# Altium schematic sheet haptic_ring_prototype.SchDoc
size A4
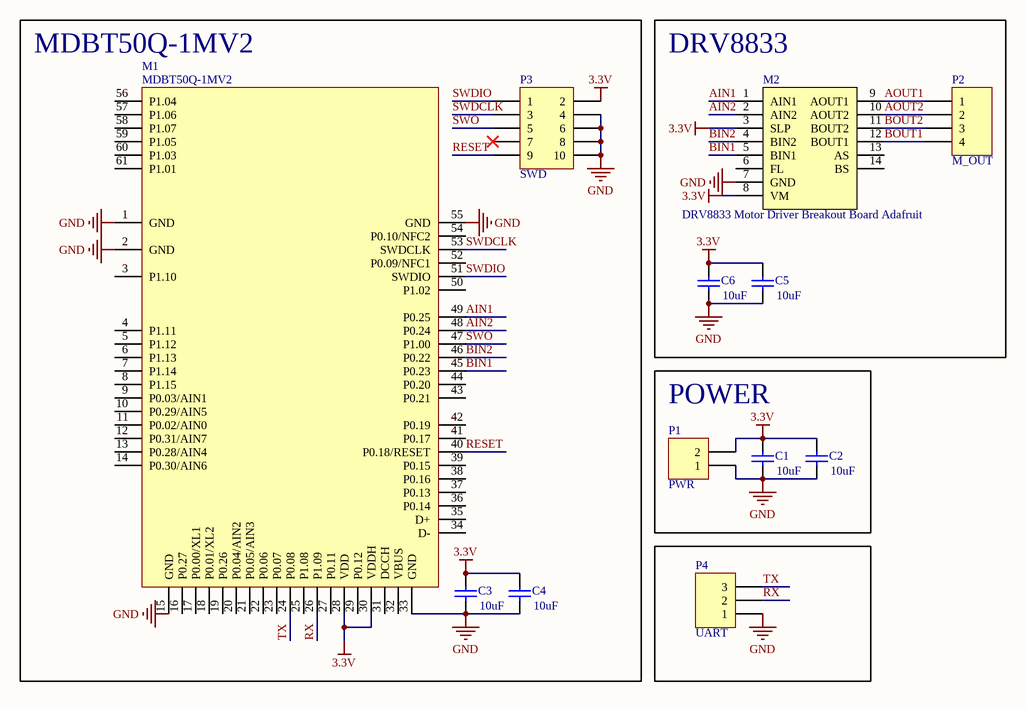
[diagram p0: haptic_ring_prototype.SchDoc]

## Parts
C1  value 10uF  [C_0402]  (hidden comment: Cap Semi)
C2  value 10uF  [C_0402]  (hidden comment: Cap Semi)
C3  value 10uF  [C_0402]  (hidden comment: Cap Semi)
C4  value 10uF  [C_0402]  (hidden comment: Cap Semi)
C5  value 10uF  [C_0402]  (hidden comment: Cap Semi)
C6  value 10uF  [C_0402]  (hidden comment: Cap Semi)
M1  MDBT50Q-1MV2  [MDBT50Q-1MV2]
M2  DRV8833 Motor Driver Breakout Board Adafruit  [DRV8833 DC/Stepper Motor Driver Breakout Board Adafruit]
P1  PWR  [HDR1X2]
P2  M_OUT  [HDR1X4]
P3  SWD  [header male th 1.27 5x2 pins]
P4  UART  [HDR1X3]

## Blocks framed on the sheet
MDBT50Q-1MV2: C3 C4 M1 P3
DRV8833: C5 C6 M2 P2
POWER: C1 C2 P1

## Nets
3.3V: C1.2 C2.2 C3.2 C4.2 C5.2 C6.2 M1.28(VDD) M1.30(VDDH) M2.3(SLP) M2.8(VM) P1.2 P3.2
GND: C1.1 C2.1 C3.1 C4.1 C5.1 C6.1 M1.1(GND) M1.2(GND) M1.15(GND) M1.33(GND) M1.55(GND) M2.7(GND) P1.1 P3.4 P3.6 P3.8 P3.10 P4.1
AIN1: M1.49(P0.25) M2.1(AIN1)
AIN2: M1.48(P0.24) M2.2(AIN2)
AOUT1: M2.9(AOUT1) P2.1
AOUT2: M2.10(AOUT2) P2.2
BIN1: M1.45(P0.23) M2.5(BIN1)
BIN2: M1.46(P0.22) M2.4(BIN2)
BOUT1: M2.12(BOUT1) P2.4
BOUT2: M2.11(BOUT2) P2.3
RESET: M1.40(P0.18/RESET) P3.9
RX: M1.26(P1.09) P4.2
SWDCLK: M1.53(SWDCLK) P3.3
SWDIO: M1.51(SWDIO) P3.1
SWO: M1.47(P1.00) P3.5
TX: M1.24(P0.08) P4.3

Not connected (* = marked no-connect by the designer): M1 3(P1.10) 4(P1.11) 5(P1.12) 6(P1.13) 7(P1.14) 8(P1.15) 9(P0.03/AIN1) 10(P0.29/AIN5) 11(P0.02/AIN0) 12(P0.31/AIN7) 13(P0.28/AIN4) 14(P0.30/AIN6) 16(P0.27) 17(P0.00/XL1) 18(P0.01/XL2) 19(P0.26) 20(P0.04/AIN2) 21(P0.05/AIN3) 22(P0.06) 23(P0.07) 25(P1.08) 27(P0.11) 29(P0.12) 31(DCCH) 32(VBUS) 34(D-) 35(D+) 36(P0.14) 37(P0.13) 38(P0.16) 39(P0.15) 41(P0.17) 42(P0.19) 43(P0.21) 44(P0.20) 50(P1.02) 52(P0.09/NFC1) 54(P0.10/NFC2) 56(P1.04) 57(P1.06) 58(P1.07) 59(P1.05) 60(P1.03) 61(P1.01); M2 6(FL) 13(AS) 14(BS); P3 7*

## Library data of the parts
C1-C6 = Cap Semi: Capacitor (Semiconductor SIM Model); Published: 8-Jun-2000; LatestRevisionDate: 29-May-2009; LatestRevisionNote: IPC-7351 Footprint Added.; PackageReference: C1206; Publisher: Altium Limited; PackageDescription: Chip Capacitor
M1 = MDBT50Q_52840
M2 = DRV8833 DC/Stepper Motor Driver Breakout Board Adafruit
P1 = Header 2: Header, 2-Pin; LatestRevisionDate: 17-Jul-2002; LatestRevisionNote: Re-released for DXP Platform.; Publisher: Altium Limited
P2 = Header 4: Header, 4-Pin; LatestRevisionDate: 17-Jul-2002; LatestRevisionNote: Re-released for DXP Platform.; Publisher: Altium Limited
P3 = Header 5X2: Header, 5-Pin, Dual row; LatestRevisionDate: 17-Jul-2002; LatestRevisionNote: Re-released for DXP Platform.; Publisher: Altium Limited
P4 = Header 3: Header, 3-Pin; LatestRevisionDate: 17-Jul-2002; LatestRevisionNote: Re-released for DXP Platform.; Publisher: Altium Limited